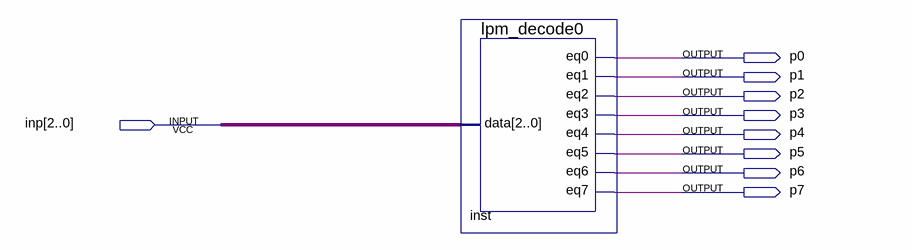
[diagram p0: schematic sheet]
// Quartus schematic ab5.bdf as structural Verilog: 1 symbols, 9 pins
module ab5 (
  input  [2:0] inp,
  output p0,
  output p1,
  output p2,
  output p3,
  output p4,
  output p5,
  output p6,
  output p7
);

  lpm_decode0 inst (.data(inp), .eq0(p0), .eq1(p1), .eq2(p2), .eq3(p3), .eq4(p4), .eq5(p5), .eq6(p6), .eq7(p7));
endmodule
